# EAGLE design FAL65816_Audio (EAGLE 7.2.0)
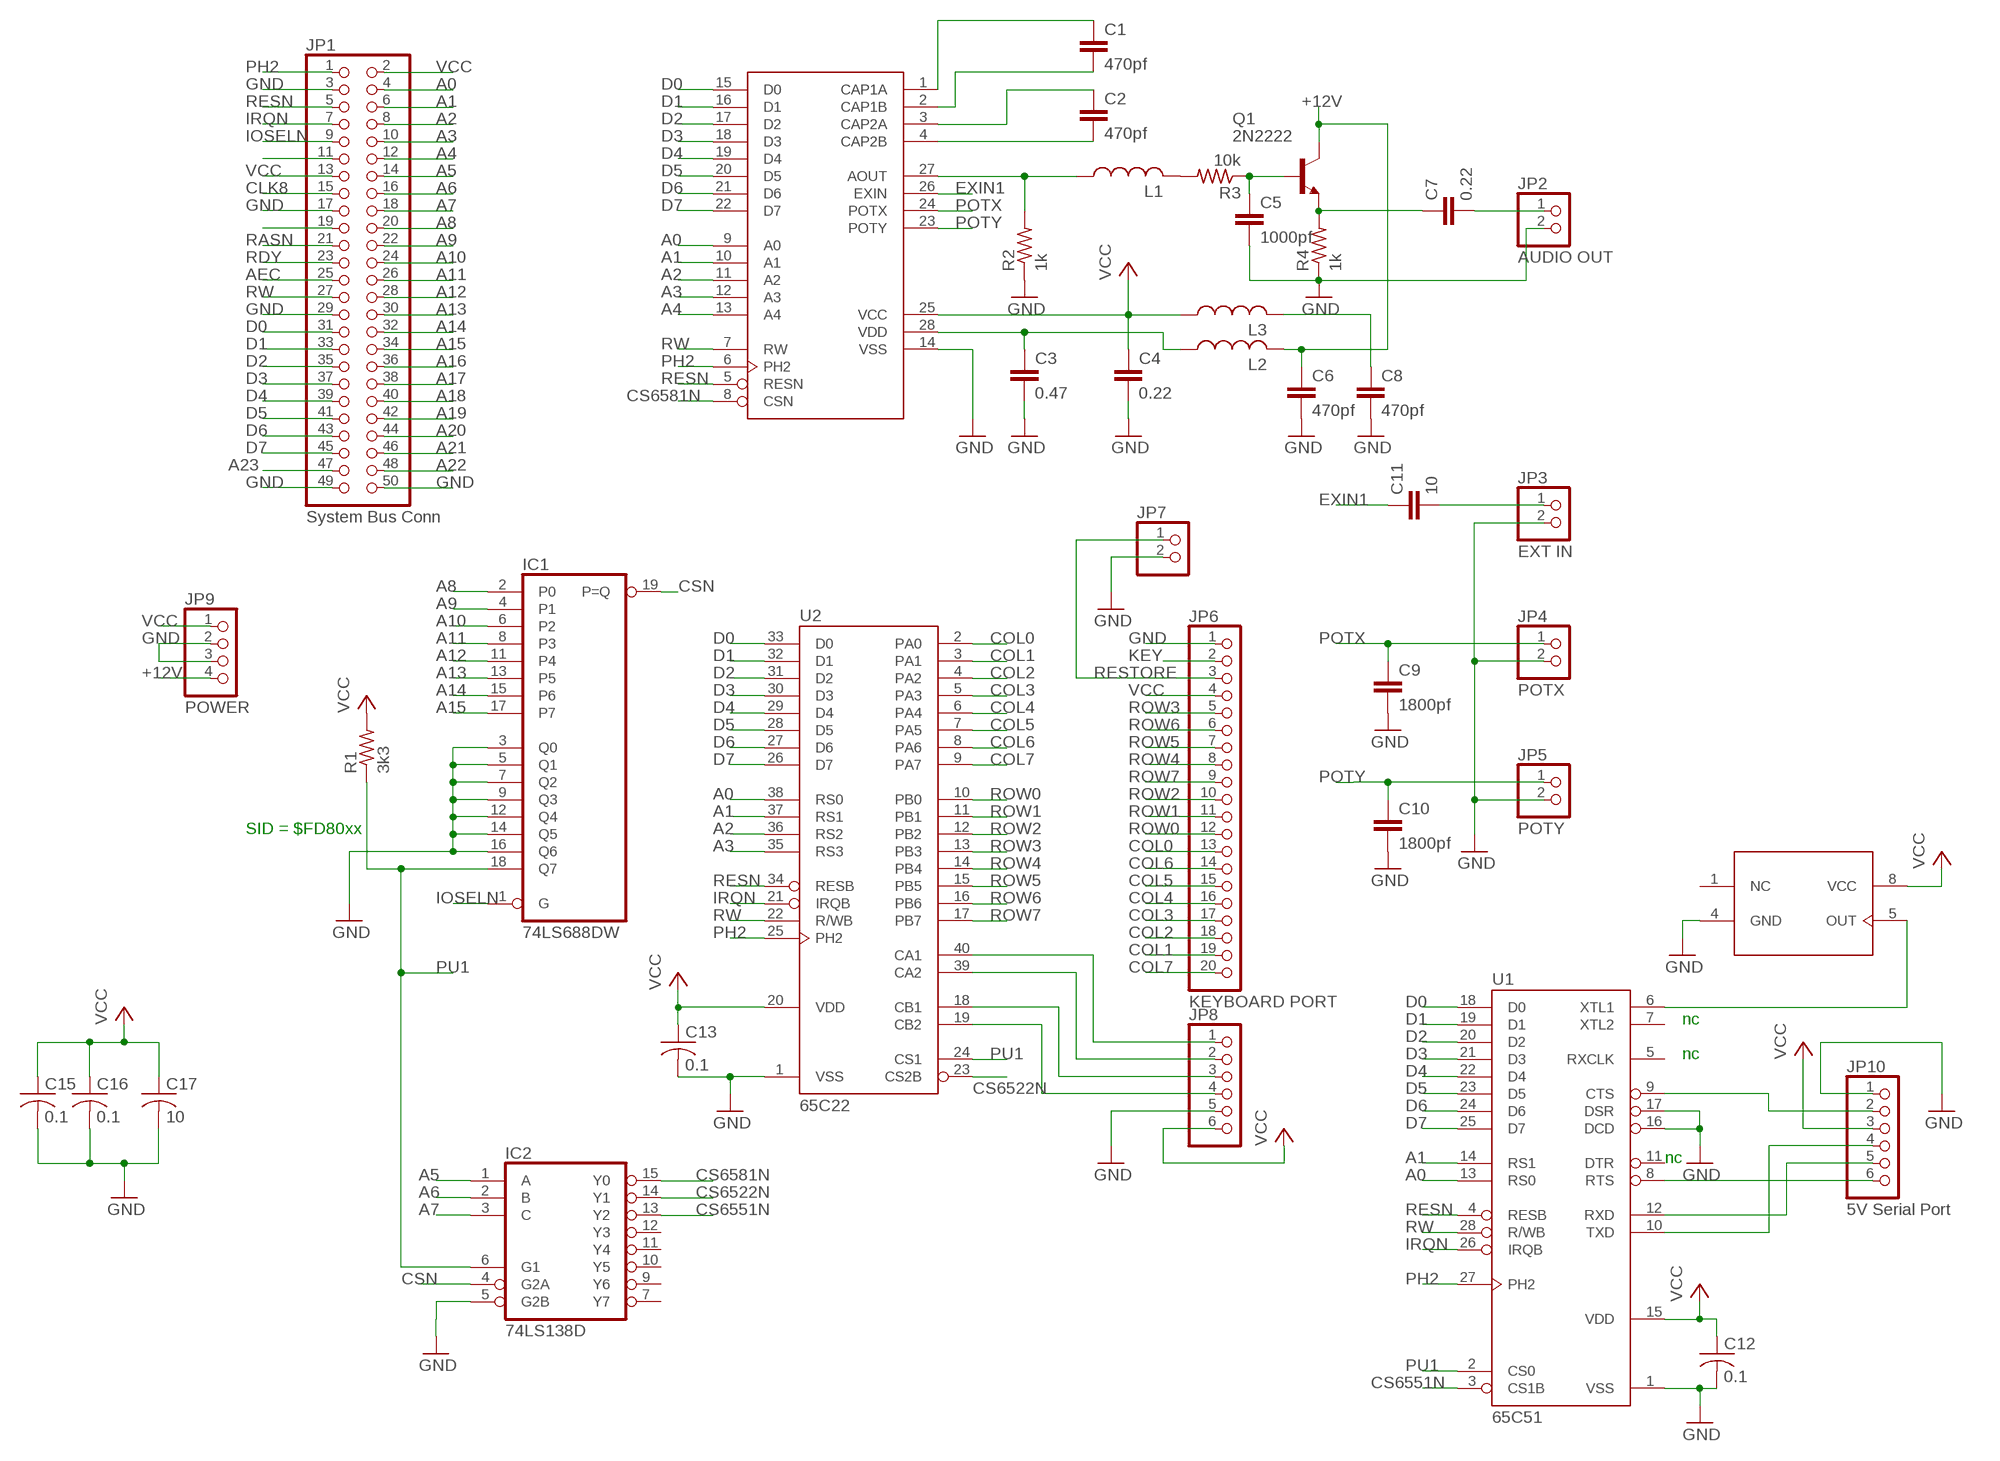
[diagram p0: schematic, sheet 1]

## Parts
C1  470pf  C-EU050-024X044  [C050-024X044]
C2  470pf  C-EU050-024X044  [C050-024X044]
C3  0.47  C-EU050-024X044  [C050-024X044]
C4  0.22  C-EU050-024X044  [C050-024X044]
C5  1000pf  C-EU050-024X044  [C050-024X044]
C6  470pf  C-EU050-024X044  [C050-024X044]
C7  0.22  C-EU050-024X044  [C050-024X044]
C8  470pf  C-EU050-024X044  [C050-024X044]
C9  1800pf  C-EU050-024X044  [C050-024X044]
C10  1800pf  C-EU050-024X044  [C050-024X044]
C11  10  C-EU050-024X044  [C050-024X044]
C12  0.1  C-US050-024X044  [C050-024X044]
C13  0.1  C-US050-024X044  [C050-024X044]
C15  0.1  C-US050-024X044  [C050-024X044]
C16  0.1  C-US050-024X044  [C050-024X044]
C17  10  C-US050-024X044  [C050-024X044]
IC1  74LS688DW  [SO20W]
IC2  74LS138D  [SO16]
JP1  System Bus Conn  PINHD-2X25/90  [2X25/90]
JP2  AUDIO OUT  PINHD-1X2  [1X02]
JP3  EXT IN  PINHD-1X2  [1X02]
JP4  POTX  PINHD-1X2  [1X02]
JP5  POTY  PINHD-1X2  [1X02]
JP6  KEYBOARD PORT  PINHD-1X20  [1X20]
JP7  PINHD-1X2  [1X02]
JP8  PINHD-1X6/90  [1X06/90]
JP9  POWER  PINHD-1X4/90  [1X04/90]
JP10  5V Serial Port  PINHD-1X6/90  [1X06/90]
L1  L-US0204/7  [0204/7]
L2  L-US0204/7  [0204/7]
L3  L-US0204/7  [0204/7]
Q1  2N2222  [TO18]
R1  3k3  R-US_0204/7  [0204/7]
R2  1k  R-US_0204/7  [0204/7]
R3  10k  R-US_0204/7  [0204/7]
R4  1k  R-US_0204/7  [0204/7]
U1  65C51  G65SC51P  [DIP-28]
U2  65C22  G65SC22P  [DIP-40]
U$1  6581  FT6581  [DIP-28]
U$2  OSC  [DIL08]

## Nets
+12V: C6.1 JP9.4 L2.2 Q1.3(C)
A0: JP1.4 U1.13(RS0) U2.38(RS0) U$1.9(A0)
A1: JP1.6 U1.14(RS1) U2.37(RS1) U$1.10(A1)
A2: JP1.8 U2.36(RS2) U$1.11(A2)
A3: JP1.10 U2.35(RS3) U$1.12(A3)
A4: JP1.12 U$1.13(A4)
A5: IC2.1(A) JP1.14
A6: IC2.2(B) JP1.16
A7: IC2.3(C) JP1.18
A8: IC1.2(P0) JP1.20
A9: IC1.4(P1) JP1.22
A10: IC1.6(P2) JP1.24
A11: IC1.8(P3) JP1.26
A12: IC1.11(P4) JP1.28
A13: IC1.13(P5) JP1.30
A14: IC1.15(P6) JP1.32
A15: IC1.17(P7) JP1.34
A16: JP1.36
A17: JP1.38
A18: JP1.40
A19: JP1.42
A20: JP1.44
A21: JP1.46
A22: JP1.48
A23: JP1.47
AEC: JP1.25
CLK8: JP1.15
COL0: JP6.13 U2.2(PA0)
COL1: JP6.19 U2.3(PA1)
COL2: JP6.18 U2.4(PA2)
COL3: JP6.17 U2.5(PA3)
COL4: JP6.16 U2.6(PA4)
COL5: JP6.15 U2.7(PA5)
COL6: JP6.14 U2.8(PA6)
COL7: JP6.20 U2.9(PA7)
CS6522N: IC2.14(Y1) U2.23(CS2B)
CS6551N: IC2.13(Y2) U1.3(CS1B)
CS6581N: IC2.15(Y0) U$1.8(CSN)
CSN: IC1.19(P=Q) IC2.4(G2A)
D0: JP1.31 U1.18(D0) U2.33(D0) U$1.15(D0)
D1: JP1.33 U1.19(D1) U2.32(D1) U$1.16(D1)
D2: JP1.35 U1.20(D2) U2.31(D2) U$1.17(D2)
D3: JP1.37 U1.21(D3) U2.30(D3) U$1.18(D3)
D4: JP1.39 U1.22(D4) U2.29(D4) U$1.19(D4)
D5: JP1.41 U1.23(D5) U2.28(D5) U$1.20(D5)
D6: JP1.43 U1.24(D6) U2.27(D6) U$1.21(D6)
D7: JP1.45 U1.25(D7) U2.26(D7) U$1.22(D7)
EXIN1: C11.1 U$1.26(EXIN)
GND: C3.2 C4.2 C5.2 C6.2 C8.2 C9.2 C10.2 C12.2 C13.2 C15.2 C16.2 C17.2 IC1.3(Q0) IC1.5(Q1) IC1.7(Q2) IC1.9(Q3) IC1.12(Q4) IC1.14(Q5) IC1.16(Q6) IC2.5(G2B) JP1.3 JP1.17 JP1.29 JP1.49 JP1.50 JP2.2 JP3.2 JP4.2 JP5.2 JP6.1 JP7.2 JP8.5 JP9.2 JP9.3 JP10.1 R2.1 R4.1 U1.1(VSS) U1.16(DCD) U1.17(DSR) U2.1(VSS) U$1.14(VSS) U$2.4(GND)
IOSELN: IC1.1(G) JP1.9
IRQN: JP1.7 U1.26(IRQB) U2.21(IRQB)
KEY: JP6.2
N$1: C1.1 U$1.1(CAP1A)
N$2: C1.2 U$1.2(CAP1B)
N$3: C2.1 U$1.3(CAP2A)
N$4: C2.2 U$1.4(CAP2B)
N$5: L1.1 R2.2 U$1.27(AOUT)
N$6: C3.1 L2.1 U$1.28(VDD)
N$7: L1.2 R3.2
N$8: C5.1 Q1.2(B) R3.1
N$9: C7.1 Q1.1(E) R4.2
N$11: C7.2 JP2.1
N$12: C8.1 L3.2
N$16: C11.2 JP3.1
N$17: JP10.2 U1.9(CTS)
N$18: JP1.19
N$20: JP10.4 U1.10(TXD)
N$21: JP10.5 U1.12(RXD)
N$22: JP10.6 U1.8(RTS)
N$23: JP8.1 U2.40(CA1)
N$24: JP8.2 U2.39(CA2)
N$25: JP8.3 U2.18(CB1)
N$26: JP8.4 U2.19(CB2)
N$28: U1.6(XTL1) U$2.5(OUT)
N$40: JP1.11
PH2: JP1.1 U1.27(PH2) U2.25(PH2) U$1.6(PH2)
POTX: C9.1 JP4.1 U$1.24(POTX)
POTY: C10.1 JP5.1 U$1.23(POTY)
PU1: IC1.18(Q7) IC2.6(G1) R1.1 U1.2(CS0) U2.24(CS1)
RASN: JP1.21
RDY: JP1.23
RESN: JP1.5 U1.4(RESB) U2.34(RESB) U$1.5(RESN)
RESTORE: JP6.3 JP7.1
ROW0: JP6.12 U2.10(PB0)
ROW1: JP6.11 U2.11(PB1)
ROW2: JP6.10 U2.12(PB2)
ROW3: JP6.5 U2.13(PB3)
ROW4: JP6.8 U2.14(PB4)
ROW5: JP6.7 U2.15(PB5)
ROW6: JP6.6 U2.16(PB6)
ROW7: JP6.9 U2.17(PB7)
RW: JP1.27 U1.28(R/WB) U2.22(R/WB) U$1.7(RW)
VCC: C4.1 C12.1 C13.1 C15.1 C16.1 C17.1 JP1.2 JP1.13 JP6.4 JP8.6 JP9.1 JP10.3 L3.1 R1.2 U1.15(VDD) U2.20(VDD) U$1.25(VCC) U$2.8(VCC)
Unconnected: IC2.7(Y7) IC2.9(Y6) IC2.10(Y5) IC2.11(Y4) IC2.12(Y3) U1.5(RXCLK) U1.7(XTL2) U1.11(DTR) U$2.1(NC)

## Notes on the sheet
- SID = $FD80xx
- nc
- nc
- nc

## Power pins joined to a net without a drawn wire
GND: IC1.10(GND) IC2.8(GND)
VCC: IC1.20(VCC) IC2.16(VCC)

## Library data of the parts
C1-C11 = rcl:C-EU: CAPACITOR, European symbol
C12 C13 C15-C17 = resistor:C-US: CAPACITOR, American symbol
IC1 = FT74xx:74*688: 8-bit MAGNITUDE/IDENTITY COMPARATOR, totem pole
IC2 = FT74xx:74*138: 3-line to 8-line DECODER/DEMULTIPLEXER
JP1 = pinhead:PINHD-2X25: PIN HEADER
JP2-JP5 JP7 = pinhead:PINHD-1X2: PIN HEADER
JP6 = pinhead:PINHD-1X20: PIN HEADER
JP8 JP10 = pinhead:PINHD-1X6: PIN HEADER
JP9 = pinhead:PINHD-1X4: PIN HEADER
L1-L3 = resistor:L-US: INDUCTOR, American symbol
Q1 = transistor-npn:2N2222*: NPN Transistor
R1-R4 = resistor:R-US_: RESISTOR, American symbol
U1 = 65xxx:G65SC51P: California Micro Devices Version
U2 = 65xxx:G65SC22P: California Micro Devices Version
U$1 = 65xxx:FT6581: Sound interface device
U$2 = FT74xx:OSC

## Board
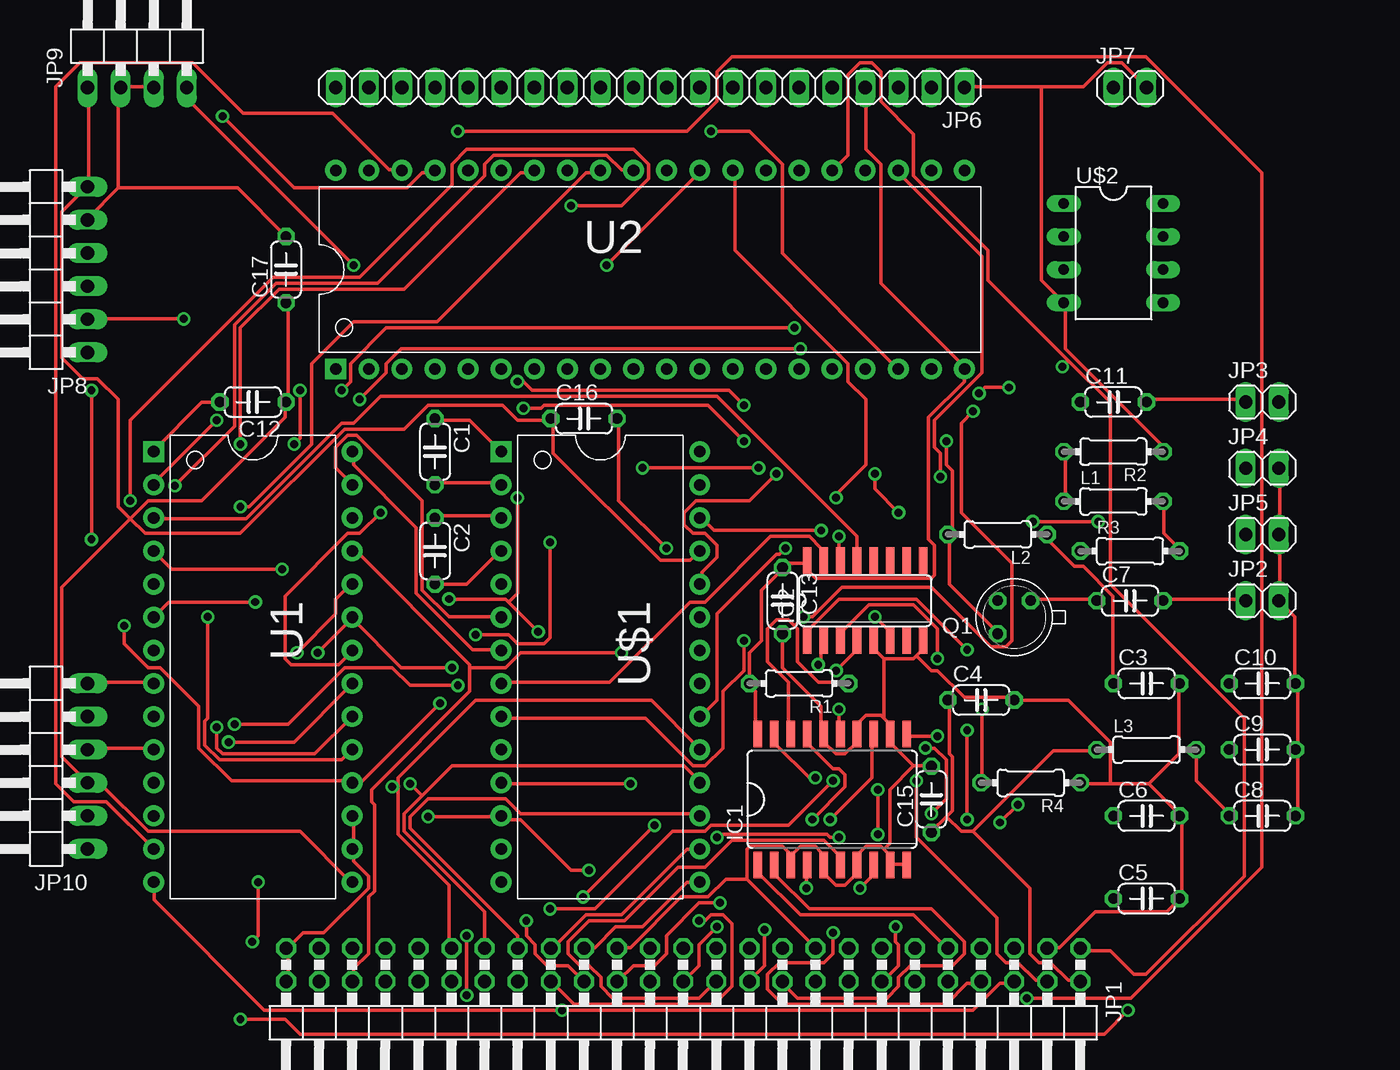
[diagram p1: board, top side]
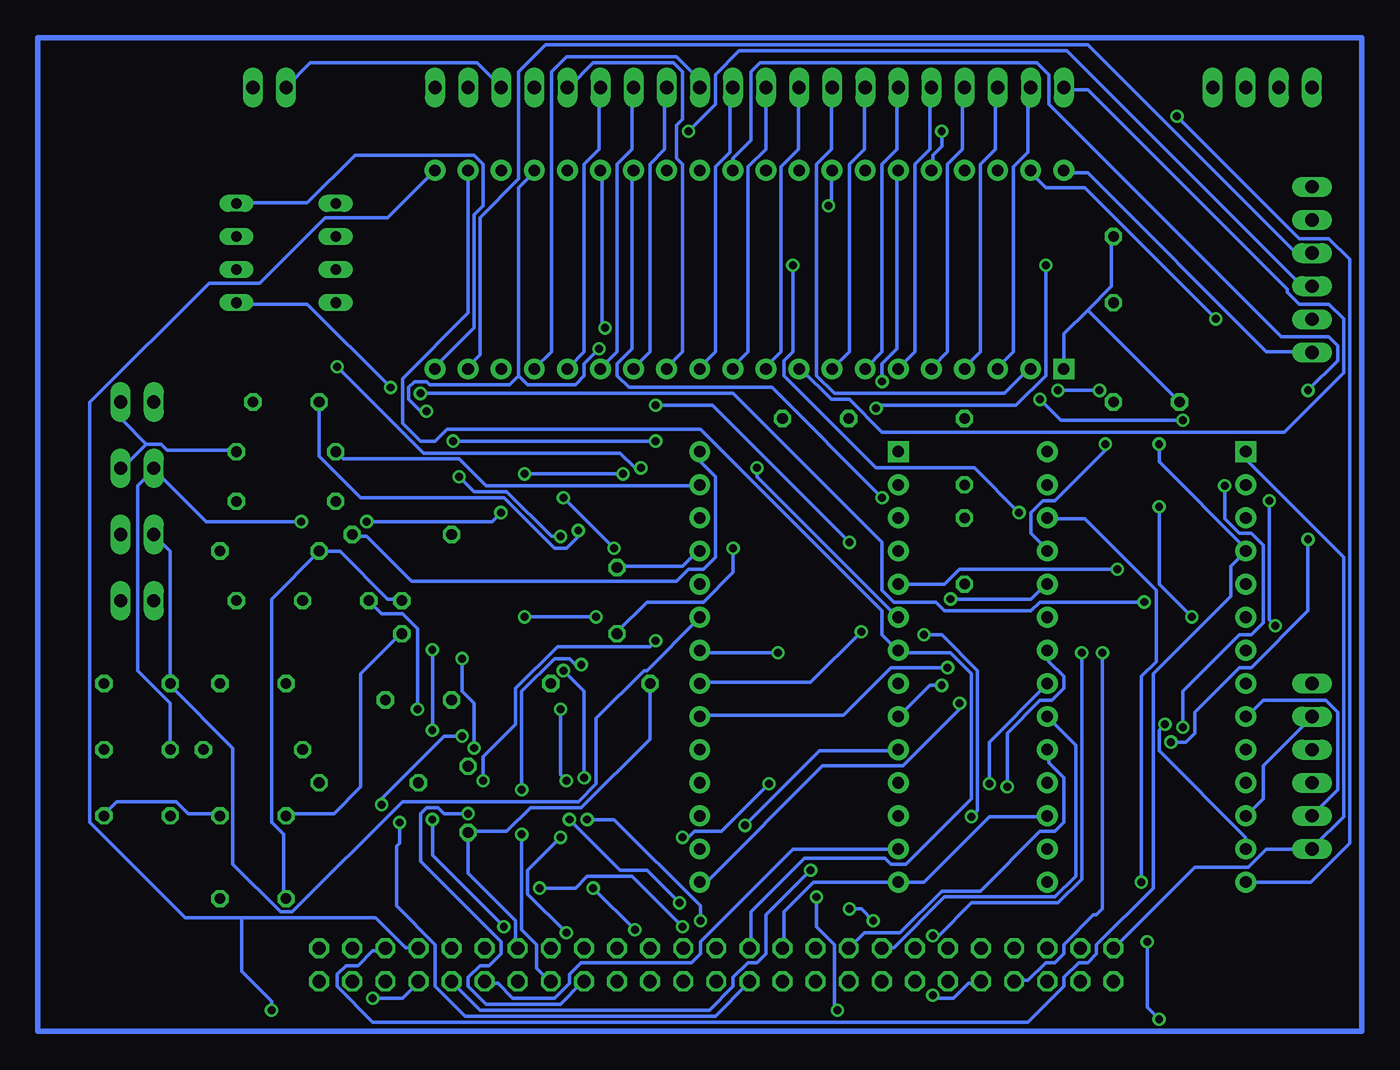
[diagram p2: board, bottom side, seen from below]

No outline drawn. Coordinates in mm, seen from the top.
Copper layers (1*16): Top 0.035mm / dielectric 1.5mm / Bottom 0.035mm
Design rules "default": minimum track width 10mil, minimum drill 24mil, track to track 8mil, track to pad 8mil, pad to pad 8mil, via to via 8mil, smd to smd 8mil, copper to edge 40mil, drill to drill 8mil, minimum pad ring 10mil, minimum via ring 8mil, stop-mask expansion 4mil, vias tented up to drill 0mil, thermal gap 10mil

### Footprints (pad centres in the part's own frame; a part is rotated, then mirrored left to right if it is on the bottom)
C050-024X044 = drill 0.813 octagon: 1 -2.54,0; 2 2.54,0
SO20W = smd 0.66 x 2.032: 1 -5.715,-5.029; 2 -4.445,-5.029; 3 -3.175,-5.029; 4 -1.905,-5.029; 5 -0.635,-5.029; 6 0.635,-5.029; 7 1.905,-5.029; 8 3.175,-5.029; 9 4.445,-5.029; 10 5.715,-5.029; 11 5.715,5.029; 12 4.445,5.029; 13 3.175,5.029; 14 1.905,5.029; 15 0.635,5.029; 16 -0.635,5.029; 17 -1.905,5.029; 18 -3.175,5.029; 19 -4.445,5.029; 20 -5.715,5.029
SO16 = smd 0.66 x 2.032: 1 -4.445,-3.073; 2 -3.175,-3.073; 3 -1.905,-3.073; 4 -0.635,-3.073; 5 0.635,-3.073; 6 1.905,-3.073; 7 3.175,-3.073; 8 4.445,-3.073; 9 4.445,3.073; 10 3.175,3.073; 11 1.905,3.073; 12 0.635,3.073; 13 -0.635,3.073; 14 -1.905,3.073; 15 -3.175,3.073; 16 -4.445,3.073
2X25/90 = drill 1.016 octagon: 1 -29.21,-6.35; 2 -29.21,-3.81; 3 -26.67,-6.35; 4 -26.67,-3.81; 5 -24.13,-6.35; 6 -24.13,-3.81; 7 -21.59,-6.35; 8 -21.59,-3.81; 9 -19.05,-6.35; 10 -19.05,-3.81; 11 -16.51,-6.35; 12 -16.51,-3.81; 13 -13.97,-6.35; 14 -13.97,-3.81; 15 -11.43,-6.35; 16 -11.43,-3.81; 17 -8.89,-6.35; 18 -8.89,-3.81; 19 -6.35,-6.35; 20 -6.35,-3.81; 21 -3.81,-6.35; 22 -3.81,-3.81; 23 -1.27,-6.35; 24 -1.27,-3.81; 25 1.27,-6.35; 26 1.27,-3.81; 27 3.81,-6.35; 28 3.81,-3.81; 29 6.35,-6.35; 30 6.35,-3.81; 31 8.89,-6.35; 32 8.89,-3.81; 33 11.43,-6.35; 34 11.43,-3.81; 35 13.97,-6.35; 36 13.97,-3.81; 37 16.51,-6.35; 38 16.51,-3.81; 39 19.05,-6.35; 40 19.05,-3.81; 41 21.59,-3.81; 42 21.59,-6.35; 43 24.13,-3.81; 44 24.13,-6.35; 45 26.67,-3.81; 46 26.67,-6.35; 47 29.21,-3.81; 48 29.21,-6.35; 49 31.75,-3.81; 50 31.75,-6.35
1X02 = drill 1.016 long: 1 -1.27,0; 2 1.27,0
1X20 = drill 1.016 long: 1 -24.13,0; 2 -21.59,0; 3 -19.05,0; 4 -16.51,0; 5 -13.97,0; 6 -11.43,0; 7 -8.89,0; 8 -6.35,0; 9 -3.81,0; 10 -1.27,0; 11 1.27,0; 12 3.81,0; 13 6.35,0; 14 8.89,0; 15 11.43,0; 16 13.97,0; 17 16.51,0; 18 19.05,0; 19 21.59,0; 20 24.13,0
1X06/90 = drill 1.016 long: 1 -6.35,-3.81; 2 -3.81,-3.81; 3 -1.27,-3.81; 4 1.27,-3.81; 5 3.81,-3.81; 6 6.35,-3.81
1X04/90 = drill 1.016 long: 1 -3.81,-3.81; 2 -1.27,-3.81; 3 1.27,-3.81; 4 3.81,-3.81
0204/7 = drill 0.813 octagon: 1 -3.81,0; 2 3.81,0
TO18 = drill 0.813 octagon: 1 -1.27,-1.27; 2 1.27,-1.27; 3 1.27,1.27
DIP-28 = drill 0.889 pad 1.6 square: 1 -15.24,-7.62 | drill 0.889 pad 1.6: 2 -12.7,-7.62; 3 -10.16,-7.62; 4 -7.62,-7.62; 5 -5.08,-7.62; 6 -2.54,-7.62; 7 0,-7.62; 8 2.54,-7.62; 9 5.08,-7.62; 10 7.62,-7.62; 11 10.16,-7.62; 12 12.7,-7.62; 13 15.24,-7.62; 14 17.78,-7.62; 15 17.78,7.62; 16 15.24,7.62; 17 12.7,7.62; 18 10.16,7.62; 19 7.62,7.62; 20 5.08,7.62; 21 2.54,7.62; 22 0,7.62; 23 -2.54,7.62; 24 -5.08,7.62; 25 -7.62,7.62; 26 -10.16,7.62; 27 -12.7,7.62; 28 -15.24,7.62
DIP-40 = drill 0.889 pad 1.6 square: 1 -22.86,-7.62 | drill 0.889 pad 1.6: 2 -20.32,-7.62; 3 -17.78,-7.62; 4 -15.24,-7.62; 5 -12.7,-7.62; 6 -10.16,-7.62; 7 -7.62,-7.62; 8 -5.08,-7.62; 9 -2.54,-7.62; 10 0,-7.62; 11 2.54,-7.62; 12 5.08,-7.62; 13 7.62,-7.62; 14 10.16,-7.62; 15 12.7,-7.62; 16 15.24,-7.62; 17 17.78,-7.62; 18 20.32,-7.62; 19 22.86,-7.62; 20 25.4,-7.62; 21 25.4,7.62; 22 22.86,7.62; 23 20.32,7.62; 24 17.78,7.62; 25 15.24,7.62; 26 12.7,7.62; 27 10.16,7.62; 28 7.62,7.62; 29 5.08,7.62; 30 2.54,7.62; 31 0,7.62; 32 -2.54,7.62; 33 -5.08,7.62; 34 -7.62,7.62; 35 -10.16,7.62; 36 -12.7,7.62; 37 -15.24,7.62; 38 -17.78,7.62; 39 -20.32,7.62; 40 -22.86,7.62
DIL08 = drill 0.813 long: 1 -3.81,-3.81; 2 -1.27,-3.81; 3 1.27,-3.81; 4 3.81,-3.81; 5 3.81,3.81; 6 1.27,3.81; 7 -1.27,3.81; 8 -3.81,3.81

### Placement (x,y rotation side)
C1  30.48,44.45 270 top
C2  30.48,36.83 270 top
C3  85.09,26.67 0 top
C4  72.39,25.4 0 top
C5  85.09,10.16 0 top
C6  85.09,16.51 0 top
C7  83.82,33.02 0 top
C8  93.98,16.51 0 top
C9  93.98,21.59 0 top
C10  93.98,26.67 0 top
C11  82.55,48.26 0 top
C12  16.51,48.26 180 top
C13  57.15,33.02 270 top
C15  68.58,17.78 90 top
C16  41.91,46.99 0 top
C17  19.05,58.42 90 top
IC1  60.96,17.78 0 top
IC2  63.5,33.02 0 top
JP1  50.8,0 180 top
JP2  93.98,33.02 0 top
JP3  93.98,48.26 0 top
JP4  93.98,43.18 0 top
JP5  93.98,38.1 0 top
JP6  46.99,72.39 180 top
JP7  83.82,72.39 0 top
JP8  0,58.42 90 top
JP9  7.62,76.2 0 top
JP10  0,20.32 90 top
L1  82.55,40.64 0 top
L2  73.66,38.1 180 top
L3  85.09,21.59 0 top
Q1  74.93,31.75 180 top
R1  58.42,26.67 180 top
R2  82.55,44.45 180 top
R3  83.82,36.83 0 top
R4  76.2,19.05 180 top
U1  16.51,29.21 270 top
U2  45.72,58.42 0 top
U$1  43.18,29.21 270 top
U$2  82.55,59.69 270 top

### Tracks (layer width: path | path; a pad name or v marks a point on that pad's centre or on a via)
+12V  (via drill 0.61)
  Top 0.254: Q1.3 73.61,30.63 69.95,34.29 69.95,37.95 L2.2 69.95,38.18 70.18,38.41 70.18,42.98 69.72,43.43 v69.72,45.26 | JP9.4 11.43,71.55 v24.23,58.75 | v37.26,47.78 38.63,47.78 38.86,48.01 51.44,48.01 v54.18,45.26
  Bottom 0.254: C6.1 82.53,16.69 78.87,16.69 76.81,18.75 76.81,27.43 73.84,30.4 Q1.3 | v24.23,58.75 24.23,50.29 26.52,48.01 37.03,48.01 v37.26,47.78 | v69.72,45.26 v54.18,45.26
A0  (via drill 0.61)
  Top 0.254: v67.44,19.2 67.44,14.86 73.61,8.69 73.61,5.94 74.3,5.26 75.21,5.26 76.58,3.89 77.27,3.89 JP1.4 | v54.18,29.95 54.18,27.66 52.58,26.06 52.58,21.72 51.21,20.34 50.29,20.34 46.63,24 35.66,24 U$1.9 | v15.09,23.55 19.2,23.55 23.55,27.89 27.2,27.89 28.57,26.52 v32.23,26.52 | U1.13 5.26,17.6 2.74,17.6 1.37,18.97 1.37,72.47 3.2,74.3 11.89,74.3 15.77,70.41 22.63,70.41 26.98,66.06 27.89,66.06 U2.38
  Bottom 0.254: v67.44,19.2 67.44,21.03 64.92,23.55 64.92,26.29 61.72,29.49 54.63,29.49 v54.18,29.95 | v15.09,23.55 15.54,23.09 15.54,21.49 8.91,14.86 8.91,14.17 U1.13 | v32.23,26.52 33.15,26.52 35.43,24.23 U$1.9
A1  (via drill 0.61)
  Top 0.254: JP1.6 74.75,3.66 73.84,3.66 71.78,1.6 v40.23,1.6 17.37,1.6 8.91,10.06 8.91,11.43 U1.14 | v41.83,10.29 v47.32,15.77 | v14.17,70.18 19.66,64.69 28.35,64.69 29.49,65.84 30.4,65.84 U2.37
  Bottom 0.254: v47.32,15.77 41.6,21.49 35.66,21.49 U$1.10 | v41.83,10.29 41.83,8 40.46,6.63 40.46,1.83 v40.23,1.6 | v14.17,70.18 4.8,60.81 2.52,60.81 0.91,59.21 0.91,14.4 3.89,11.43 U1.14
A2  (via drill 0.61)
  Top 0.254: v61.04,7.54 61.04,5.94 60.35,5.26 56.92,5.26 56.01,4.34 56.01,3.2 57.15,2.06 69.72,2.06 71.32,3.66 72.24,3.66 JP1.8 | v61.49,14.86 60.81,14.86 60.58,15.09 52.35,15.09 v52.12,14.86 | v45.49,18.97 35.66,18.97 U$1.11 | v32.23,69.04 49.84,69.04 52.12,71.32 52.12,73.61 53.26,74.75 85.04,74.75 93.95,65.84 93.95,12.57 83.9,2.52 v75.89,2.52
  Bottom 0.254: v61.04,7.54 64.01,10.52 64.01,12.34 v61.49,14.86 | v52.12,14.86 51.66,14.86 51.21,15.32 49.15,15.32 v45.49,18.97 | v32.23,69.04 32.23,67.89 32.92,67.21 32.92,66.06 U2.36 | v75.89,2.52 73.61,2.52 72.47,3.66 JP1.8
A3  (via drill 0.61)
  Top 0.254: v42.29,12.34 40.92,12.34 37.03,16.23 35.89,16.23 35.66,16.46 U$1.12 35.43,16.46 v29.95,16.46 | v36.8,49.84 37.26,49.84 37.95,49.15 53.03,49.15 v54.18,48.01 | v39.32,37.49 39.32,30.18 38.86,29.72 36.8,29.72 36.12,30.4 v33.6,30.4
  Bottom 0.254: v42.29,12.34 45.72,8.91 45.72,5.94 46.41,5.26 47.09,5.26 48.23,4.12 48.23,3.43 50.06,1.6 67.67,1.6 69.72,3.66 JP1.10 | v36.8,49.84 36.8,51.21 35.66,52.35 35.66,65.84 U2.35 | v54.18,48.01 49.84,48.01 v39.32,37.49 | v33.6,30.4 32.23,30.4 29.49,27.66 29.49,16.92 v29.95,16.46
A4
  Bottom 0.254: JP1.12 67.21,3.66 66.29,3.66 65.15,2.52 61.95,2.52 60.81,3.66 60.81,4.34 59.89,5.26 51.44,5.26 50.75,5.94 50.75,6.86 43.66,13.95 35.66,13.95 U$1.13
A5  (via drill 0.61)
  Top 0.254: v71.32,29.26 67.44,33.15 61.49,33.15 59.21,30.86 59.21,29.95 IC2.1 | v71.32,16.23 v71.32,23.09 | v65.84,8 65.84,6.86 66.06,6.63 66.06,5.03 64.92,3.89 JP1.14
  Bottom 0.254: v71.32,23.09 v71.32,29.26 | v71.32,16.23 71.32,13.49 v65.84,8
A6  (via drill 0.61)
  Top 0.254: v59.89,28.12 60.12,28.35 60.12,29.95 IC2.2 | v64.47,15.09 v64.47,18.52
  Bottom 0.254: v59.89,28.12 60.35,28.12 60.81,28.57 61.95,28.57 64.47,26.06 v64.47,18.52 | v64.47,15.09 64.47,7.77 63.32,6.63 63.32,4.8 62.41,3.89 JP1.16
A7  (via drill 0.61)
  Top 0.254: v69.04,28.57 69.04,30.86 67.21,32.69 63.78,32.69 61.72,30.63 61.72,29.95 IC2.3 | v68.12,21.72 68.81,21.72 69.72,20.8 69.72,17.83 v68.58,16.69
  Bottom 0.254: v69.04,28.57 69.04,26.06 68.12,25.15 v68.12,21.72 | v68.58,16.69 70.41,16.69 70.87,17.14 71.78,17.14 72.24,16.69 72.24,13.03 66.06,6.86 66.06,5.94 66.98,5.03 67.67,5.03 68.58,4.12 68.58,3.43 67.21,2.06 61.49,2.06 59.89,3.66 JP1.18
A8
  Top 0.254: IC1.2 56.69,12.57 56.69,11.89 59.21,9.37 68.58,9.37 71.09,6.86 71.09,5.94 70.18,5.03 66.98,5.03 66.06,4.12 66.06,3.43 65.15,2.52 58.29,2.52 57.15,3.66 JP1.20
A9  (via drill 0.61)
  Top 0.254: v58.98,10.97 58.98,12.57 IC1.4 | v55.78,7.77 55.78,5.03 54.63,3.89 JP1.22
  Bottom 0.254: v55.78,7.77 v58.98,10.97
A10
  Top 0.254: IC1.6 61.49,12.8 61.49,13.49 60.35,14.63 53.26,14.63 51.21,12.57 49.15,12.57 45.03,8.46 42.29,8.46 40.69,6.86 40.69,5.94 41.6,5.03 42.29,5.03 43.2,4.12 43.2,3.43 44.12,2.52 50.75,2.52 51.89,3.66 JP1.24
A11  (via drill 0.61)
  Top 0.254: v63.09,10.97 64.01,11.89 64.01,12.57 IC1.8 | v52.12,8 50.75,6.63 50.75,5.03 JP1.26
  Bottom 0.254: v63.09,10.97 60.35,10.97 59.44,11.89 56.01,11.89 v52.12,8
A12  (via drill 0.61)
  Top 0.254: v69.04,22.63 66.75,22.63 IC1.11 | v73.84,16 v75.21,17.37
  Bottom 0.254: v69.04,22.63 70.41,22.63 75.21,17.83 v75.21,17.37 | v73.84,16 73.84,14.4 74.07,14.17 74.07,9.6 71.09,6.63 71.09,3.43 68.81,1.14 49.61,1.14 47.09,3.66 JP1.28
A13  (via drill 0.61)
  Top 0.254: v60.81,16.23 64.01,19.43 64.01,22.63 IC1.13 | v52.35,9.83 50.75,9.83 48.23,7.32 48.23,5.94 47.32,5.03 45.72,5.03 44.58,3.89 JP1.30
  Bottom 0.254: v60.81,16.23 56.92,12.34 54.86,12.34 v52.35,9.83
A14  (via drill 0.61)
  Top 0.254: v61.49,24.69 61.49,22.86 IC1.15 | v61.04,19.2 57.61,15.77 51.66,15.77 51.21,15.32 48.69,15.32 42.75,9.37 v39.32,9.37 | v37.49,8.46 37.49,7.32 38.18,6.63 38.18,5.94 39.09,5.03 40.69,5.03 JP1.32
  Bottom 0.254: v61.49,24.69 61.49,19.66 v61.04,19.2 | v39.32,9.37 38.41,9.37 v37.49,8.46
A15  (via drill 0.61)
  Top 0.254: v59.44,16.23 61.95,18.75 61.95,19.66 61.49,20.12 61.04,20.12 59.21,21.95 59.21,22.63 IC1.17 | v50.75,8.46 51.21,8.46 51.66,8.91 52.58,8.91 53.26,8.23 53.26,3.43 51.89,2.06 41.15,2.06 39.55,3.66 JP1.34
  Bottom 0.254: v59.44,16.23 57.38,16.23 50.75,9.6 v50.75,8.46
COL0
  Bottom 0.254: JP6.13 40.69,72.24 40.69,67.67 41.83,66.52 41.83,50.29 40.46,48.92 27.43,48.92 25.6,50.75 U2.2
COL1
  Bottom 0.254: JP6.19 25.6,72.24 25.6,67.44 26.75,66.29 26.75,52.12 27.89,50.98 U2.3
COL2
  Bottom 0.254: JP6.18 28.12,72.24 28.12,67.67 29.26,66.52 29.26,52.12 30.4,50.98 U2.4
COL3
  Bottom 0.254: JP6.17 30.63,72.24 30.63,67.67 31.77,66.52 31.77,52.12 32.92,50.98 U2.5
COL4
  Bottom 0.254: JP6.16 33.15,72.24 33.15,67.67 34.29,66.52 34.29,52.12 35.43,50.98 U2.6
COL5
  Bottom 0.254: JP6.15 35.66,72.24 35.66,67.67 36.8,66.52 36.8,52.12 37.95,50.98 U2.7
COL6
  Bottom 0.254: U2.8 39.32,52.12 39.32,66.52 38.18,67.67 38.18,72.24 JP6.14
COL7
  Bottom 0.254: JP6.20 22.86,72.24 21.03,72.24 5.71,56.92 5.71,56.69 4.8,55.78 2.52,55.78 1.37,54.63 1.37,50.52 5.94,45.95 36.8,45.95 39.32,48.46 40.69,48.46 42.98,50.75 U2.9
CS6522N  (via drill 0.61)
  Top 0.254: v61.49,37.95 61.49,36.12 IC2.14 | v69.27,42.52 69.27,44.35 68.81,44.81 68.81,46.86 72.47,50.52 72.47,59.44 66.06,65.84 U2.23
  Bottom 0.254: v61.49,37.95 62.18,37.95 65.61,41.38 68.12,41.38 v69.27,42.52
CS6551N
  Top 0.254: IC2.13 62.87,37.95 52.12,48.69 26.29,48.69 24.23,46.63 23.32,46.63 16,39.32 8.91,39.32 U1.3
CS6581N
  Top 0.254: IC2.15 60.12,36.12 60.12,37.03 59.21,37.95 56.24,37.95 51.21,32.92 50.06,32.92 43.89,26.75 35.66,26.75 U$1.8
CSN  (via drill 0.61)
  Top 0.254: v59.66,19.43 59.21,19.43 56.69,21.95 56.69,22.63 IC1.19 | v61.27,27.66 62.87,29.26 IC2.4
  Bottom 0.254: v59.66,19.43 59.66,26.06 v61.27,27.66
D0  (via drill 0.61)
  Top 0.254: U$1.15 49.84,11.43 46.41,8 44.35,8 42.75,6.4 42.06,6.4 JP1.31 | v30.86,25.15 24.92,19.2 24.23,19.2 U1.18 24,19.2 14.86,19.2 12.34,21.72 12.34,24.92 9.37,27.89 8.46,27.89 6.63,29.72 v6.63,31.09 | v40.92,63.32 44.81,63.32 46.86,65.38 46.86,66.52 45.72,67.67 32.92,67.67 31.77,66.52 31.77,64.92 24.69,57.84 18.06,57.84 7.09,46.86 v7.09,40.69
  Bottom 0.254: v30.86,25.15 30.86,24.69 35.2,20.34 41.38,20.34 50.29,11.43 U$1.15 | v40.92,63.32 40.69,63.55 40.69,65.84 U2.33 | v7.09,40.69 7.09,31.55 v6.63,31.09
D1  (via drill 0.61)
  Top 0.254: JP1.33 39.55,6.4 42.06,8.91 44.81,8.91 49.84,13.95 50.75,13.95 U$1.16 | v15.54,40.23 16.23,40.23 21.03,45.03 21.03,51.21 24.23,54.41 30.63,54.41 42.06,65.84 42.98,65.84 U2.32 | v13.03,31.77 13.03,24 12.8,23.77 12.8,21.95 13.95,20.8 23.32,20.8 24,21.49 U1.19
  Bottom 0.254: JP1.33 38.18,7.54 35.43,7.54 32.23,10.74 29.26,10.74 24.69,15.32 23.55,15.32 22.86,16 22.86,19.43 24,20.57 24,21.49 U1.19 | v15.54,40.23 15.54,34.29 v13.03,31.77
D2  (via drill 0.61)
  Top 0.254: U$1.17 50.75,16.69 37.03,16.69 35.89,17.83 29.95,17.83 28.57,16.46 28.57,15.54 36.8,7.32 36.8,6.4 JP1.35 | v10.52,41.83 15.09,46.41 15.09,54.18 18.29,57.38 26.06,57.38 34.29,65.61 34.29,66.52 34.98,67.21 43.66,67.21 44.81,66.06 45.72,66.06 U2.31 | v13.72,23.32 13.72,21.72 14.17,21.26 21.26,21.26 U1.20
  Bottom 0.254: U1.20 21.95,21.95 21.95,11.89 23.55,10.29 32,10.29 35.89,6.4 36.8,6.4 JP1.35 | v10.52,41.83 10.52,39.32 9.37,38.18 8.46,38.18 7.54,37.26 7.54,31.32 8.46,30.4 9.37,30.4 13.72,26.06 v13.72,23.32
D3  (via drill 0.61)
  Top 0.254: JP1.37 34.29,9.14 28.12,15.32 28.12,16.69 29.49,18.06 | 29.49,18.06 31.77,20.34 49.61,20.34 50.75,19.2 U$1.18 | 29.49,18.06 v28.57,18.97 | v4.12,37.72 v4.12,49.15 | v14.63,22.17 19.66,22.17 24,26.52 U1.21
  Bottom 0.254: v28.57,18.97 28.57,22.17 24.23,26.52 U1.21 | v4.12,49.15 1.83,51.44 1.83,52.58 2.52,53.26 6.17,53.26 24,71.09 24,73.38 24.92,74.3 46.18,74.3 46.86,73.61 46.86,68.35 48.23,66.98 48.23,66.06 U2.30 | v4.12,37.72 4.12,32.23 8.46,27.89 9.37,27.89 12.8,24.46 12.8,22.86 13.49,22.17 v14.63,22.17
D4  (via drill 0.61)
  Top 0.254: 27.66,18.75 27.66,19.43 33.6,25.38 47.09,25.38 50.75,21.72 U$1.19 | 27.66,18.75 27.66,15.09 31.55,11.2 31.55,6.4 JP1.39 | 27.66,18.75 v27.2,18.75 | v43.66,58.75 50.75,65.84 U2.29 | v26.29,39.78 24.69,38.18 23.77,38.18 18.97,33.38 18.97,28.57 19.43,28.12 23.09,28.12 24,29.03 U1.22
  Bottom 0.254: v27.2,18.75 27.2,22.86 24.69,25.38 23.77,25.38 22.86,26.29 22.86,27.2 24,28.35 24,29.03 U1.22 | v43.66,58.75 43.66,52.12 44.35,51.44 44.35,50.29 37.26,43.2 29.72,43.2 v26.29,39.78
D5  (via drill 0.61)
  Top 0.254: v32.92,7.32 v32.92,2.74 | v21.49,29.03 24,31.55 U1.23 24.23,31.55 27.89,27.89 v31.77,27.89 | v61.27,40.92 61.27,41.15 63.55,43.43 63.55,48.46 62.18,49.84 62.18,51.21 53.49,59.89 53.49,65.84 U2.28 | v57.38,37.03 56.92,36.58 56.69,36.58 52.12,32 52.12,25.38 50.98,24.23 U$1.20
  Bottom 0.254: v32.92,2.74 32.69,2.52 31.32,2.52 30.18,3.66 29.26,3.66 JP1.41 | v32.92,7.32 32.46,7.32 29.95,9.83 23.32,9.83 21.49,11.66 v21.49,29.03 | v31.77,27.89 36.12,27.89 39.78,24.23 50.75,24.23 U$1.20 | v57.38,37.03 v61.27,40.92
D6  (via drill 0.61)
  Top 0.254: v19.89,29.03 22.86,32 22.86,33.15 24,34.29 U1.24 | 36.12,32.92 35.89,33.15 v31.55,33.15 | 36.12,32.92 v38.41,30.63 | v36.8,40.92 36.8,33.6 36.12,32.92
  Bottom 0.254: v19.89,29.03 19.89,9.37 20.34,8.91 20.57,8.91 22.86,6.63 22.86,5.94 23.55,5.26 24.23,5.26 25.6,3.89 26.52,3.89 JP1.43 | v38.41,30.63 42.29,26.75 50.75,26.75 U$1.21 | v31.55,33.15 25.38,33.15 24.23,34.29 U1.24 | v36.8,40.92 45.26,49.38 56.24,49.38 57.15,50.29 57.15,51.21 56.01,52.35 56.01,65.84 U2.27
D7  (via drill 0.61)
  Top 0.254: 33.15,27.89 33.15,28.12 24.23,37.03 U1.25 | 33.15,27.89 33.15,26.06 25.6,18.52 25.6,17.6 25.83,17.37 25.83,10.74 25.38,10.29 25.38,5.94 24.23,4.8 24.23,3.89 JP1.45 | v44.81,29.03 37.03,29.03 35.89,27.89 33.15,27.89 | v58.06,53.95 26.75,53.95 24,51.21 24,49.84 v23.32,49.15 | v20.12,49.15 20.12,45.49 v19.66,45.03
  Bottom 0.254: v44.81,29.03 50.75,29.03 U$1.22 | v58.06,53.95 58.29,54.18 58.29,65.84 U2.26 | v20.12,49.15 v23.32,49.15 | v19.66,45.03 19.66,44.58 23.55,40.69 24.46,40.69 25.38,39.78 25.38,38.18 24.23,37.03 U1.25
EXIN1  (via drill 0.61)
  Top 0.254: v60.12,38.41 51.89,38.41 50.98,39.32 U$1.26
  Bottom 0.254: C11.1 80.01,44.12 76.81,40.92 65.84,40.92 61.95,37.03 61.04,37.03 60.12,37.95 v60.12,38.41
GND  (via drill 0.61)
  Top 0.254: 85.27,18.97 82.3,18.97 | 82.3,18.97 80.01,18.97 R4.1 | 85.27,18.97 87.55,16.69 C6.2 87.78,16.46 87.78,10.29 C5.2 87.55,10.06 86.64,9.14 81.15,9.14 78.41,6.4 77.5,6.4 JP1.3 | 85.27,18.97 87.55,21.26 87.55,26.52 C3.2 | 77.04,72.47 80.24,72.47 82.07,74.3 83.21,74.3 85.04,72.47 JP7.2 | 77.04,72.47 71.32,72.47 JP6.1 | C8.2 96.7,16.69 96.7,21.49 C9.2 96.7,21.72 96.7,26.52 C10.2 96.47,26.75 96.47,31.77 95.33,32.92 JP2.2 95.33,33.15 95.33,37.95 JP5.2 95.33,38.18 95.33,42.98 JP4.2 | R2.1 86.18,44.58 86.18,45.03 78.87,52.35 78.87,55.78 U$2.4 78.64,56.01 77.04,57.61 77.04,72.47 | 64.92,28.57 64.24,29.26 64.24,29.95 IC2.5 | 64.92,28.57 67.21,28.57 67.44,28.8 | 67.44,28.8 67.89,29.26 67.89,29.95 IC2.8 | 67.44,28.8 68.58,27.66 69.04,27.66 71.09,25.6 74.75,25.6 C4.2 74.98,25.38 79.1,25.38 82.3,22.17 82.3,18.97 | 67.21,20.34 65.61,21.95 65.61,22.63 IC1.12 65.38,22.86 65.38,23.55 64.92,24 | 67.21,20.34 68.58,20.34 C15.2 | C13.2 57.15,27.89 60.12,24.92 60.12,22.86 IC1.16 60.35,22.63 60.35,22.17 61.27,21.26 61.95,21.26 62.87,22.17 IC1.14 62.87,23.55 63.55,24.23 64.69,24.23 64.92,24 | v48.23,37.03 44.58,40.69 44.58,46.86 C16.2 | 64.92,24 64.92,28.57 | 6.17,64.69 3.89,62.41 JP8.5 | 6.17,64.69 6.17,72.24 JP9.2 6.4,72.47 8.69,72.47 JP9.3 | C12.2 13.95,48.23 12.57,48.23 8.91,44.58 U1.1 | 6.17,64.69 15.32,64.69 C17.2 | U1.17 24.23,16.46 24.23,14.17 U1.16 24.23,13.95 24.23,13.03 25.38,11.89 25.38,10.97 21.95,7.54 20.34,7.54 19.2,6.4 JP1.50 19.2,6.17 19.2,3.89 JP1.49 | IC1.10 66.52,12.8 65.61,12.8 IC1.9 65.38,12.8 65.38,13.49 64.92,13.95 | 57.84,13.49 57.84,12.8 IC1.3 57.84,13.49
  Top 0.254: 57.84,13.49 58.52,14.17 59.66,14.17 60.12,13.72 60.12,12.8 IC1.5 60.35,12.57 60.35,12.12 61.27,11.2 61.95,11.2 62.87,12.12 IC1.7 62.87,13.49 63.55,14.17 64.69,14.17 64.92,13.95 | 54.41,11.66 59.66,6.4 JP1.17 | 54.41,11.66 54.41,13.95 54.63,14.17 57.15,14.17 57.84,13.49 | 54.41,11.66 52.81,11.66 51.44,10.29 49.38,10.29 45.49,6.4 44.58,6.4 JP1.29 | 67.21,20.34 65.38,18.52 65.38,14.4 64.92,13.95
  Bottom 0.254: 93.27,45.03 92.13,45.03 91.67,44.58 86.41,44.58 R2.1 | 93.27,45.03 95.1,43.2 JP4.2 | 93.27,45.03 95.1,46.86 95.1,48.23 JP3.2 | C6.2 87.78,16.69 90.07,16.69 90.98,17.6 95.56,17.6 96.47,16.69 C8.2 | v48.23,37.03 48.23,35.2 50.52,32.92 54.86,32.92 57.15,30.63 C13.2 | 21.03,55.32 22.86,53.49 U2.1 | 21.03,55.32 19.2,57.15 19.2,60.81 C17.2 | 21.03,55.32 C12.2 | JP1.50 18.97,6.4 12.8,12.57 8.69,12.57 7.32,13.95 3.89,13.95 JP10.1 3.66,14.17 1.37,16.46 1.37,36.35 8.69,43.66 8.69,44.35 U1.1 | JP1.29 44.35,6.4 44.35,9.14 42.06,11.43 U$1.14 33.6,11.43 28.57,16.46 24.23,16.46 U1.17
IOSELN
  Top 0.254: IC1.1 55.32,12.57 55.32,12.12 58.52,8.91 67.21,8.91 69.72,6.4 JP1.9
IRQN  (via drill 0.61)
  Top 0.254: v16.92,11.43 16.92,7.32 v16.46,6.86 | v15.54,0.91 18.97,0.91 20.12,-0.23 81.84,-0.23 v83.67,1.6
  Bottom 0.254: 85.95,8.69 90.3,8.69 97.61,16 97.61,48.23 88.47,57.38 84.58,57.38 79.55,62.41 74.75,62.41 U2.21 | 85.95,8.69 75.67,8.69 73.38,6.4 72.47,6.4 JP1.7 | v16.92,11.43 16.92,27.2 15.77,28.35 15.77,33.83 21.26,39.32 24,39.32 U1.26 | v16.46,6.86 16.46,1.83 v15.54,0.91 | v83.67,1.6 83.67,2.29 85.95,4.57 85.95,8.69
N$1
  Top 0.254: U$1.1 33.15,46.86 30.63,46.86 C1.1
N$2
  Top 0.254: C1.2 30.63,42.06 35.43,42.06 U$1.2
N$3
  Top 0.254: C2.1 30.63,39.55 35.43,39.55 U$1.3
N$4
  Top 0.254: C2.2 32.92,34.29 35.43,36.8 U$1.4
N$5
  Top 0.254: L1.1 78.87,40.69 78.87,44.35 R2.2
  Bottom 0.254: R2.2 78.18,43.89 69.27,43.89 67.21,41.83 50.98,41.83 U$1.27
N$6
  Top 0.254: C3.1 82.53,26.75 82.53,33.38 80.24,35.66 79.55,35.66 77.27,37.95 L2.1
  Bottom 0.254: U$1.28 50.75,44.35 50.75,43.66 49.61,42.52 49.61,36.35 50.52,35.43 51.66,35.43 52.58,34.52 72.92,34.52 76.35,37.95 77.27,37.95 L2.1
N$7
  Top 0.254: L1.2 86.41,40.46 86.41,38.18 87.55,37.03 R3.2
N$8
  Bottom 0.254: 80.01,36.8 78.41,36.8 74.75,33.15 73.84,33.15 Q1.2 | 80.01,36.8 83.67,33.15 83.67,16 82.75,15.09 82.75,10.29 C5.1 | 80.01,36.8 R3.1
N$9  (via drill 0.61)
  Top 0.254: v72.47,24.69 72.47,19.2 R4.2 | C7.1 81.15,33.15 76.35,33.15 Q1.1
  Bottom 0.254: v72.47,24.69 72.47,30.86 73.61,32 75.21,32 76.12,32.92 Q1.1
N$11
  Top 0.254: C7.2 86.41,33.15 92.58,33.15 JP2.1
N$12
  Top 0.254: L3.2 88.92,21.49 88.92,19.2 91.44,16.69 C8.1
N$13
  Bottom 0.406: 0,0 0,76.2 101.6,76.2 101.6,0 0,0
N$16
  Top 0.254: C11.2 85.27,48.46 92.58,48.46 JP3.1
N$17
  Bottom 0.254: JP10.2 3.66,16.69 1.83,18.52 1.83,24.46 2.74,25.38 7.54,25.38 8.69,24.23 U1.9
N$20
  Top 0.254: JP10.4 3.89,21.72 8.69,21.72 U1.10
N$21
  Bottom 0.254: JP10.5 3.89,24 7.54,20.34 7.54,17.83 8.69,16.69 U1.12
N$22
  Top 0.254: JP10.6 3.89,26.75 8.69,26.75 U1.8
N$23
  Bottom 0.254: JP8.1 3.89,52.12 7.32,52.12 21.03,65.84 22.86,65.84 U2.40
N$24  (via drill 0.61)
  Top 0.254: v11.2,54.63 3.89,54.63 JP8.2
  Bottom 0.254: v11.2,54.63 21.26,64.69 24.23,64.69 25.38,65.84 U2.39
N$25  (via drill 0.61)
  Top 0.254: v51.66,69.04 54.63,69.04 57.15,66.52 57.15,59.66 65.84,50.98 U2.18
  Bottom 0.254: JP8.3 4.57,57.15 22.63,75.21 47.78,75.21 49.61,73.38 49.61,71.09 v51.66,69.04
N$26
  Bottom 0.254: JP8.4 3.89,59.89 5.26,59.89 21.03,75.67 62.64,75.67 64.69,73.61 64.69,65.38 67.67,62.41 67.67,51.89 68.58,50.98 U2.19
N$28  (via drill 0.61)
  Top 0.254: v74.52,49.38 72.69,49.38 v72.24,48.92 | v16.69,32.92 10.06,32.92 U1.6
  Bottom 0.254: v74.52,49.38 80.92,55.78 86.18,55.78 U$2.5 | v72.24,48.92 48.23,48.92 36.8,37.49 36.8,33.83 35.89,32.92 32.69,32.92 32,32.23 25.38,32.23 24.69,32.92 v16.69,32.92
PH2  (via drill 0.61)
  Top 0.254: U$1.6 35.43,31.77 31.55,31.77 29.49,33.83 29.49,40.69 24.46,45.72 23.77,45.72 22.86,44.81 22.86,43.2 24,42.06 U1.27 | 79.1,51.44 72.92,57.61 72.92,59.89 67.21,65.61 67.21,68.81 64.69,71.32 64.69,73.61 64.01,74.3 63.09,74.3 62.18,73.38 62.18,67.21 61.04,66.06 U2.25 | 79.1,51.44 82.3,48.23 82.3,34.29 92.58,24 92.58,11.89 85.04,4.34 84.12,4.34 82.3,6.17 80.01,6.17 JP1.1 | v55.32,43.2 v46.41,43.2 | 79.1,51.44 v78.64,50.98
  Bottom 0.254: v46.41,43.2 46.41,42.52 35.66,31.77 U$1.6 | v55.32,43.2 55.78,43.2 56.92,44.35 72.01,44.35 v78.64,50.98
POTX  (via drill 0.61)
  Top 0.254: v56.69,42.75 54.63,40.69 50.52,40.69 49.61,39.78 49.61,38.86 50.29,38.18 51.21,38.18 52.12,37.26 52.12,36.35 50.98,35.2 50.98,34.29 U$1.24 | v64.24,42.75 64.24,41.6 v66.06,39.78 | v81.38,39.09 v76.35,39.09
  Bottom 0.254: C9.1 91.44,25.15 93.95,27.66 93.95,41.83 92.81,42.98 JP4.1 92.58,42.98 88.7,39.09 v81.38,39.09 | v64.24,42.75 v56.69,42.75 | v66.06,39.78 66.75,39.09 v76.35,39.09
POTY
  Bottom 0.254: JP5.1 92.58,37.95 91.44,36.8 C10.1 91.44,26.52 86.64,21.72 86.64,12.8 82.98,9.14 82.07,9.14 73.61,17.6 60.12,17.6 58.75,18.97 58.75,24 55.09,27.66 54.86,27.66 50.98,31.55 U$1.23
PU1  (via drill 0.61)
  Top 0.254: 58.06,31.09 58.29,30.86 58.29,28.35 59.89,26.75 62.18,26.75 R1.1 | 58.06,31.09 57.61,31.55 56.69,31.55 56.01,30.86 56.01,28.35 57.61,26.75 57.61,22.86 IC1.18 | v64.24,31.77 65.38,30.63 65.38,29.95 IC2.6 | 58.06,31.09 v58.75,31.77 59.44,31.77 61.72,34.06 68.58,34.06 73.15,29.49 74.3,29.49 74.75,29.95 74.75,35.89 70.87,39.78 70.87,46.63 v71.78,47.55 | v13.72,46.86 8.91,42.06 U1.2 | v24.69,48.46 26.75,50.52 26.75,51.21 27.89,52.35 v58.52,52.35
  Bottom 0.254: v58.75,31.77 v64.24,31.77 | v13.72,46.86 23.09,46.86 v24.69,48.46 | v58.52,52.35 59.66,51.21 59.66,50.29 60.35,49.61 64.01,49.61 64.69,50.29 | 64.69,50.29 64.69,64.69 63.55,65.84 U2.24 | v71.78,47.55 72.24,47.55 73.15,48.46 73.15,49.38 72.69,49.84 71.78,49.84 71.55,49.61 65.38,49.61 64.69,50.29
RESN  (via drill 0.61)
  Top 0.254: v18.75,35.43 10.29,35.43 U1.4 | v15.54,45.03 15.54,53.95 18.52,56.92 28.12,56.92 37.03,65.84 37.95,65.84 U2.34
  Bottom 0.254: JP1.5 74.98,6.17 75.89,6.17 77.04,5.03 77.95,5.03 78.64,4.34 78.64,3.43 75.89,0.69 25.6,0.69 22.86,3.43 22.86,4.12 21.72,5.26 21.03,5.26 20.34,5.94 20.34,6.63 16,10.97 16,27.43 10.06,33.38 10.06,35.66 U1.4 8.91,37.03 15.54,43.66 v15.54,45.03 | U$1.5 32,34.29 30.86,35.43 v18.75,35.43
RESTORE
  Bottom 0.254: JP6.3 66.06,72.47 67.89,74.3 80.7,74.3 82.53,72.47 JP7.1
ROW0
  Bottom 0.254: JP6.12 43.2,72.24 43.2,67.67 44.58,66.29 44.58,52.12 45.72,50.98 U2.10
ROW1
  Bottom 0.254: JP6.11 45.72,67.67 47.09,66.29 47.09,52.12 48.23,50.98 U2.11
ROW2
  Bottom 0.254: JP6.10 48.46,72.24 48.46,67.44 49.61,66.29 49.61,52.12 50.75,50.98 U2.12
ROW3
  Bottom 0.254: JP6.5 60.81,72.47 58.98,74.3 52.81,74.3 52.12,73.61 52.12,69.95 52.58,69.49 52.58,66.98 52.12,66.52 52.12,52.12 53.26,50.98 U2.13
ROW4
  Bottom 0.254: JP6.8 53.49,72.24 53.49,67.67 54.63,66.52 54.63,52.12 55.78,50.98 U2.14
ROW5
  Bottom 0.254: JP6.7 56.01,72.24 56.01,67.67 57.15,66.52 57.15,52.12 58.29,50.98 U2.15
ROW6
  Bottom 0.254: JP6.6 58.52,72.24 58.52,67.67 59.66,66.52 59.66,52.12 60.81,50.98 U2.16
ROW7
  Bottom 0.254: U2.17 62.18,52.12 62.18,73.61 61.04,74.75 52.58,74.75 50.98,73.15 50.98,72.47 JP6.9
RW
  Top 0.254: U1.28 24.23,44.35 24.23,43.43 29.03,38.63 29.03,33.6 33.38,29.26 35.43,29.26 U$1.7
  Bottom 0.254: JP1.27 46.86,6.4 46.86,9.14 42.75,13.26 36.58,13.26 36.12,12.8 34.98,12.8 29.95,17.83 29.95,27.43 31.55,29.03 35.43,29.03 U$1.7 35.66,29.26 36.8,30.4 36.8,32.23 50.75,46.18 70.18,46.18 71.09,45.26 72.24,45.26 73.61,46.63 73.61,50.06 68.58,55.09 U2.22
VCC
  Top 0.254: JP9.1 3.89,72.24 3.89,64.92 JP8.6 3.66,64.69 1.83,62.87 1.83,51.66 3.43,50.06 4.57,50.06 6.17,48.46 6.17,40.23 7.09,39.32 | C17.1 19.2,55.78 19.2,48.46 C12.1 18.97,48.23 18.97,47.09 12.57,40.69 8.46,40.69 7.09,39.32 | U1.15 24,11.43 20.12,15.32 8.46,15.32 4.8,18.97 3.89,18.97 JP10.3 1.83,21.03 1.83,34.06 7.09,39.32 | JP6.4 63.55,72.24 63.55,67.67 64.69,66.52 64.69,57.38 71.09,50.98 U2.20 71.09,50.75 71.09,49.84 68.35,47.09 68.35,37.72 68.81,37.26 68.81,34.98 68.58,34.75 59.66,34.75 59.21,35.2 59.21,35.89 IC2.16 58.98,35.89 57.38,35.89 57.15,35.66 C13.1 57.15,35.43 55.55,33.83 55.55,29.95 54.63,29.03 54.63,26.75 R1.2 54.63,26.52 55.09,26.06 55.09,22.86 IC1.20 | 69.72,16.46 68.58,15.32 C15.1 | 69.72,16.46 70.18,16.92 70.18,21.03 69.95,21.26 69.95,25.38 C4.1 | 71.78,15.32 77.95,21.49 81.15,21.49 L3.1 | 71.78,15.32 70.87,15.32 69.72,16.46 | 71.78,15.32 76.12,10.97 76.12,5.94 76.81,5.26 77.72,5.26 79.1,3.89 80.01,3.89 JP1.2 | U$1.25 50.75,36.8 50.06,36.12 47.78,36.12 39.55,44.35 39.55,46.86 C16.1 39.32,46.86 36.8,46.86 35.66,48.01 29.95,48.01 28.12,46.18 23.55,46.18 15.54,38.18 8.23,38.18 7.09,39.32
  Bottom 0.254: U$2.8 86.18,63.55 80.92,63.55 77.27,67.21 68.12,67.21 67.44,66.52 67.44,63.32 68.12,62.64 68.12,53.95 71.09,50.98 U2.20 | JP1.13 64.92,6.4 64.92,8.46 68.58,12.12 C15.1 68.58,15.32 65.61,15.32 63.78,17.14 59.89,17.14 54.63,22.4 54.63,26.52 R1.2 | C13.1 57.15,35.66 52.12,35.66 50.98,36.8 U$1.25